# EAGLE design hcsr04bracket (EAGLE 9.2.2)
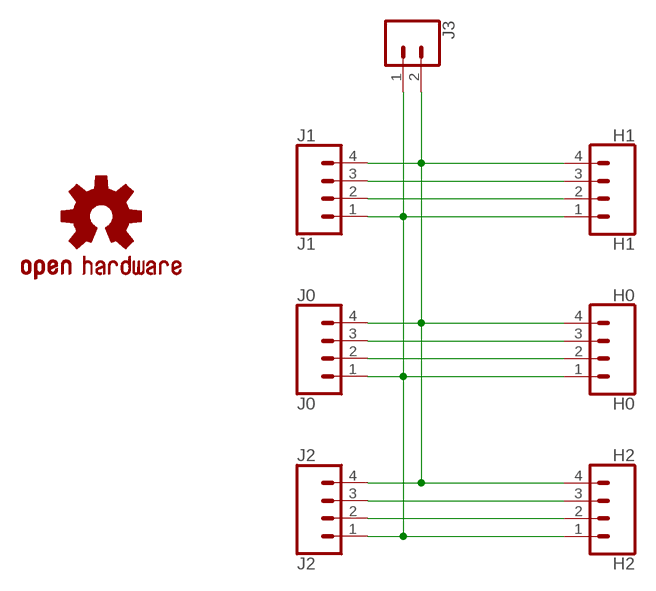
[diagram p0: schematic, sheet 1]

## Parts
H0  H0  CONN_04  [1X04]
H1  H1  CONN_04  [1X04]
H2  H2  CONN_04  [1X04]
J0  J0  CONN_04  [1X04]
J1  J1  CONN_04  [1X04]
J2  J2  CONN_04  [1X04]
J3  CONN_02  [1X02]
LOGO1  OSHW-LOGOS  [OSHW-LOGO-S]

## Nets
E1: H1.3 J1.3
E2: H0.3 J0.3
E3: H2.3 J2.3
GND: H0.4 H1.4 H2.4 J0.4 J1.4 J2.4 J3.2
T1: H1.2 J1.2
T2: H0.2 J0.2
T3: H2.2 J2.2
VCC: H0.1 H1.1 H2.1 J0.1 J1.1 J2.1 J3.1

## Library data of the parts
H0 H1 H2 J0 J1 J2 = mystuff:CONN_04: Multi connection point. Often used as Generic Header-pin footprint for 0.1 inch spaced/style header connections On any of the 0.1 inch spaced packages, you can populate with these: Break Away Headers - Straight <https://www.sparkfun.com/products/116> (PRT-00116) Break Away Male Headers - Right Angle <https://www.sparkfun.com/products/553> (PRT-00553) Female Headers <https://www.sparkfun.com/products/115> (PRT-00115) Break Away Headers - Machine Pin <https://www.sparkfun.com/products/117> (PRT-00117) Break Away Female Headers - Swiss Machine Pin <https://www.sparkfun.com/products/743> (PRT-00743) For SCREWTERMINALS and SPRING TERMINALS visit here: Screw Terimnals on SparkFun.com <https://www.sparkfun.com/search/results?term=Screw+Terminals> (5mm/3.5mm/2.54mm spacing) This device is also useful as a general connection point to wire up your design to another part of your project. Our various solder wires solder well into these plated through hole pads. Hook-Up Wire - Assortment (Stranded, 22 AWG) <https://www.sparkfun.com/products/11375> (PRT-11375) Hook-Up Wire - Assortment (Solid Core, 22 AWG) <https://www.sparkfun.com/products/11367> (PRT-11367) View the entire wire category on our website here <https://www.sparkfun.com/categories/141> Special notes: Molex polarized connector foot print use with SKU : PRT-08231 with associated crimp pins and housings. 1MM SMD Version SKU: PRT-10208; PROD_ID: CONN-09696
J3 = SparkFun-Connectors:CONN_02: Multi connection point. Often used as Generic Header-pin footprint for 0.1 inch spaced/style header connections On any of the 0.1 inch spaced packages, you can populate with these: Break Away Headers - Straight <https://www.sparkfun.com/products/116> (PRT-00116) Break Away Male Headers - Right Angle <https://www.sparkfun.com/products/553> (PRT-00553) Female Headers <https://www.sparkfun.com/products/115> (PRT-00115) Break Away Headers - Machine Pin <https://www.sparkfun.com/products/117> (PRT-00117) Break Away Female Headers - Swiss Machine Pin <https://www.sparkfun.com/products/743> (PRT-00743) For SCREWTERMINALS and SPRING TERMINALS visit here: Screw Terimnals on SparkFun.com <https://www.sparkfun.com/search/results?term=Screw+Terminals> (5mm/3.5mm/2.54mm spacing) This device is also useful as a general connection point to wire up your design to another part of your project. Our various solder wires solder well into these plated through hole pads. Hook-Up Wire - Assortment (Stranded, 22 AWG) <https://www.sparkfun.com/products/11375> (PRT-11375) Hook-Up Wire - Assortment (Solid Core, 22 AWG) <https://www.sparkfun.com/products/11367> (PRT-11367) View the entire wire category on our website here <https://www.sparkfun.com/categories/141> Special notes: Molex polarized connector foot print use with: PRT-08233 with associated crimp pins and housings. 2.54_SCREWTERM for use with PRT-10571. 3.5mm Screw Terminal footprints for PRT-08084 5mm Screw Terminal footprints for use with PRT-08432
LOGO1 = SparkFun-Aesthetics:OSHW-LOGO: Open-Source Hardware (OSHW) Logo This logo indicates the piece of hardware it is found on incorporates a OSHW license and/or adheres to the definition of open source hardware found here: http://freedomdefined.org/OSHW

## Board
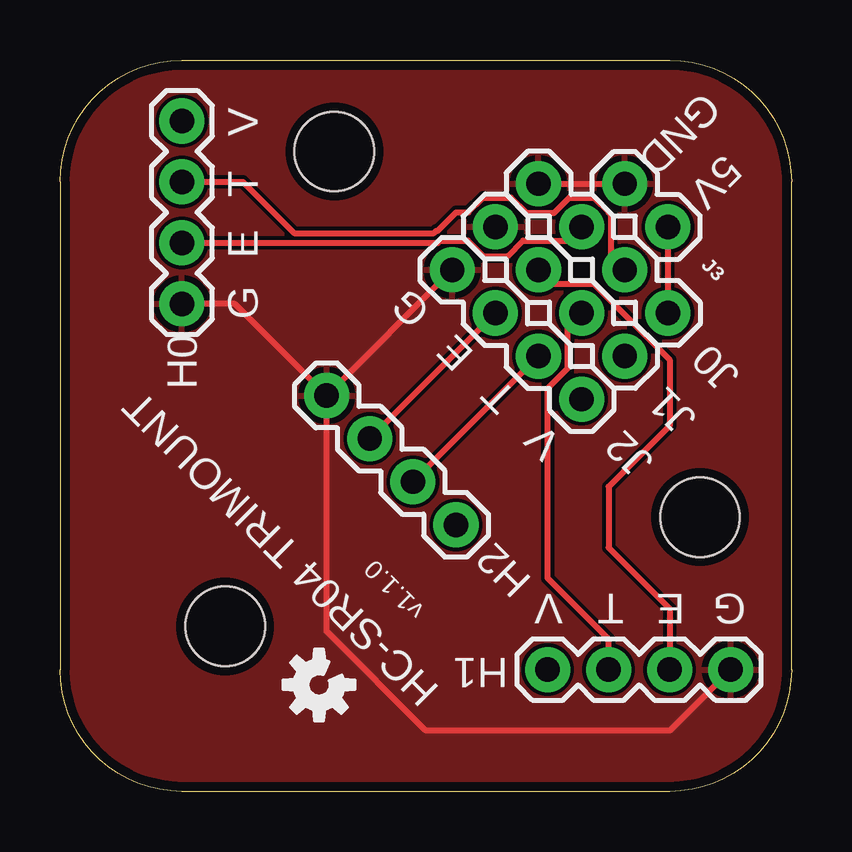
[diagram p1: board, top side]
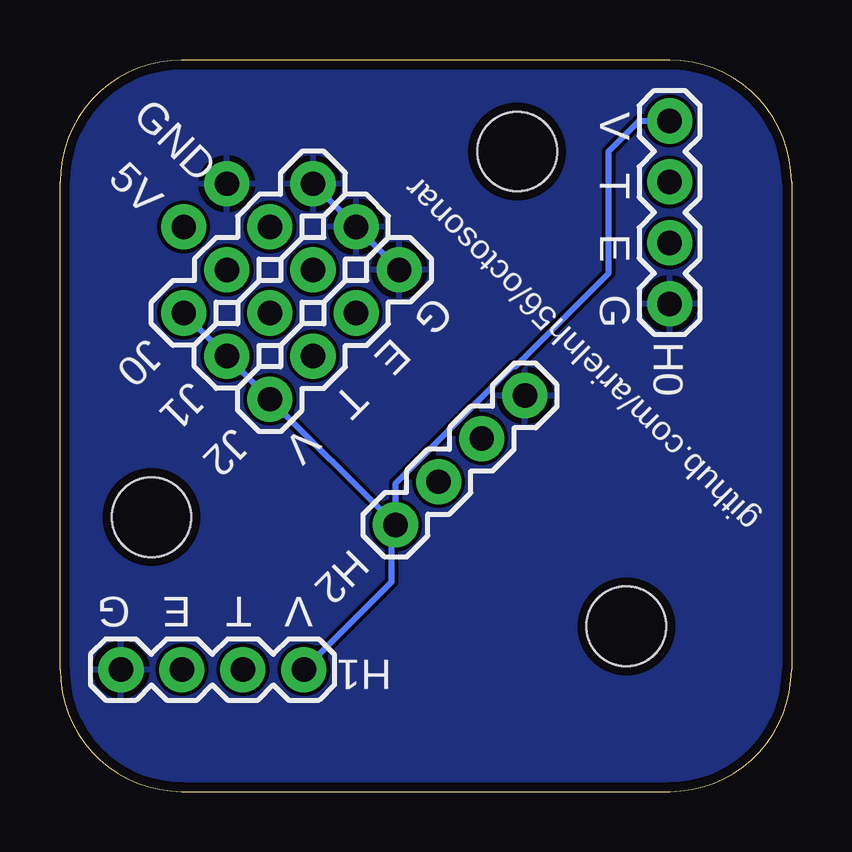
[diagram p2: board, bottom side, seen from below]

Size 30.48 x 30.48 mm. Coordinates in mm from the lower left corner, seen from the top.
Outline: 30.48,5.08 arc-90 25.4,0 5.08,0 arc-90 0,5.08 0,25.4 arc-90 5.08,30.48 25.4,30.48 arc-90 30.48,25.4 30.48,5.08
Copper layers (1*16): Top 0.0356mm / dielectric 1.5011mm / Bottom 0.0356mm
Design rules "mypcbway": minimum track width 6mil, minimum drill 13mil, track to track 6mil, track to pad 6mil, pad to pad 6mil, via to via 6mil, smd to smd 6mil, copper to edge 15mil, drill to drill 6mil, minimum pad ring 7mil, minimum via ring 7mil, stop-mask expansion 2.5mil, vias tented up to drill 24mil, thermal gap 10mil

### Footprints (pad centres in the part's own frame; a part is rotated, then mirrored left to right if it is on the bottom)
1X04 = drill 1.016 pad 1.88: 1 0,0; 2 2.54,0; 3 5.08,0; 4 7.62,0
1X02 = drill 1.016 pad 1.88: 1 0,0; 2 2.54,0
STAND-OFF = hole 3.302: 0,0

### Placement (x,y rotation side)
H0  5.08,27.94 270 top
H1  20.32,5.08 180 bottom
H2  16.5,11.11 135 top
J0  25.33,19.94 135 top
J1  23.53,18.14 135 top
J2  21.73,16.35 135 top
J3  25.33,23.53 135 top
LOGO1  10.79,4.45 135 top
U$1  [STAND-OFF]  11.43,26.67 0 top
U$2  [STAND-OFF]  26.67,11.43 0 top
U$3  [STAND-OFF]  6.88,6.88 0 top

### Tracks (layer width: path | path; a pad name or v marks a point on that pad's centre or on a via)
E1
  Top 0.254: J1.3 20.51,21.16 22.24,21.16 22.95,20.44 25.4,18 25.4,15.24 22.86,12.7 22.86,10.16 25.4,7.62 H1.3
E2
  Top 0.254: H0.3 15.75,22.86 15.84,22.95 16.99,22.95 17.64,22.31 18.65,22.31 19.29,22.95 21.16,22.95 J0.3
E3
  Top 0.254: J2.3 H2.3
GND
  Top 0.254: J2.4 H2.4 | J0.4 J3.2 | H1.4 25.4,2.54 15.24,2.54 11.11,6.67 H2.4 | H2.4 7.29,20.32 H0.4
  Bottom 0.254: J2.4 J1.4 | J1.4 | J1.4 J0.4
  pour Top: 0,0 30.48,0 30.48,30.48 0,30.48
  pour Bottom: 0,0 30.48,0 30.48,30.48 0,30.48
T1
  Top 0.254: H1.2 22.86,6.35 20.32,8.89 20.32,16.8 21.16,17.64 21.16,19.36 J1.2
T2
  Top 0.254: H0.2 7.62,25.4 9.75,23.27 15.58,23.27 15.67,23.36 15.74,23.36 16.51,24.13 17.02,24.13 17.64,24.75 18.79,24.75 19.43,24.11 20.59,24.11 21.23,24.75 22.24,24.75 22.86,24.13 22.95,24.03 22.95,22.31 J0.2
T3
  Top 0.254: J2.2 H2.2
VCC
  Top 0.254: J3.1 J0.1
  Bottom 0.254: J0.1 | J0.1 J1.1 J2.1 16.66,11.28 | 16.66,11.28 H2.1 16.5,12.84 12.33,17 11.62,17.72 11.49,17.72 7.62,21.59 7.62,26.67 6.35,27.94 H0.1 | H1.1 16.66,8.74 16.66,11.28

### Text on the board
tPlace: GND | V | 5V | T | E | G | G | E | T | V | v1.1.0 | V | T | E | G | HC-SR04 TRIMOUNT
bPlace: V | GND | T | 5V | E | G | G | E | T | V | github.com/arielnh56/octosonar | V | T | E | G